# Altium schematic sheet Audio.SchDoc: Iris
size A3; Organization: Toradex AG; Address1: Altsagenstrasse 5; Address2: Horw; Address3: 6048; Address4: Switzerland; DocumentNumber: 13; Revision: V2.0; SheetNumber: 13; SheetTotal: 16
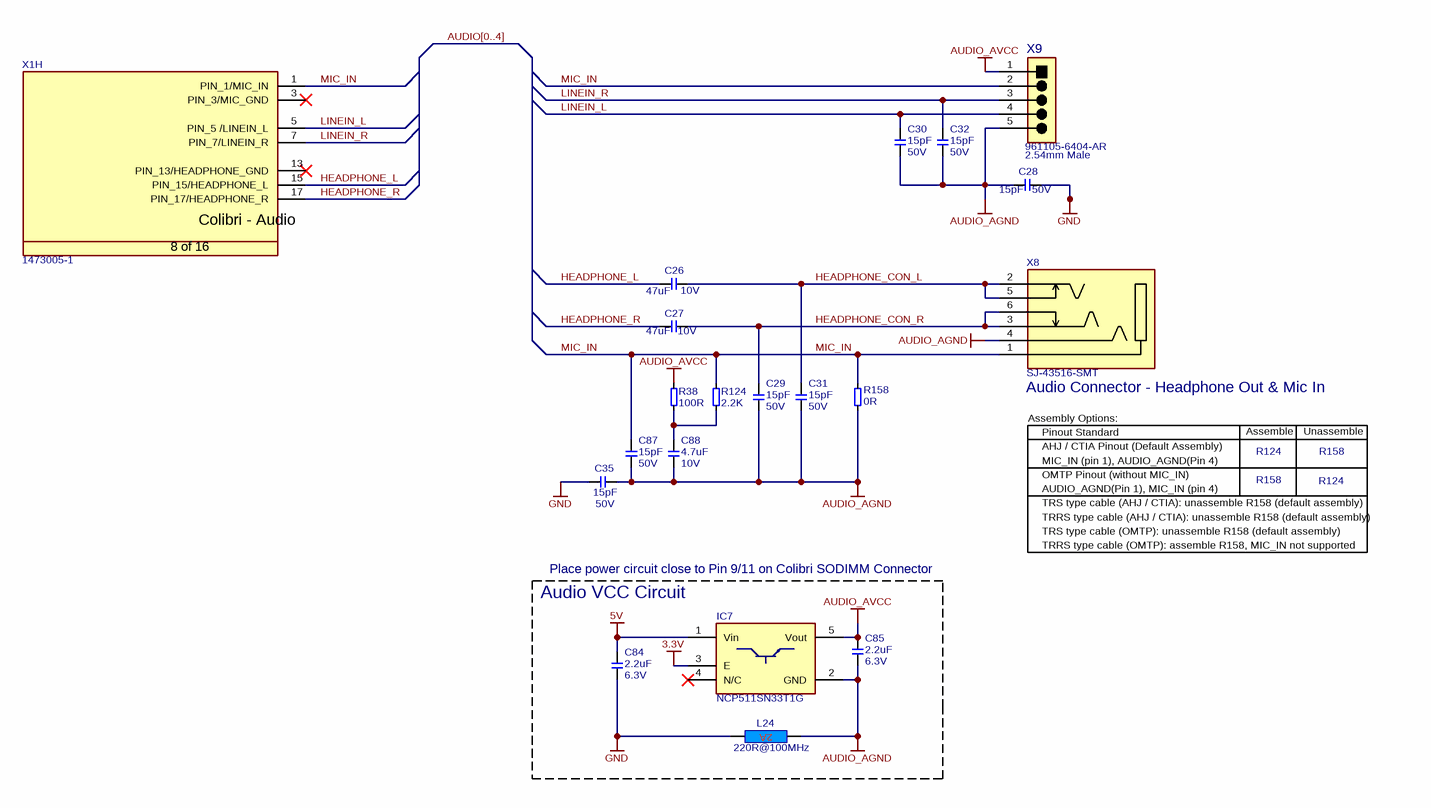
[diagram p0: Audio.SchDoc]

## Parts
C26  Rating: 10V  [T_CAPC0805X125N]  (hidden comment: 47uF)
C27  Rating: 10V  [T_CAPC0805X125N]  (hidden comment: 47uF)
C28  Rating: 50V  [CAPC1005X60N]  (hidden comment: 15pF)
C29  Rating: 50V  [CAPC1005X60N]  (hidden comment: 15pF)
C30  Rating: 50V  [CAPC1005X60N]  (hidden comment: 15pF)
C31  Rating: 50V  [CAPC1005X60N]  (hidden comment: 15pF)
C32  Rating: 50V  [CAPC1005X60N]  (hidden comment: 15pF)
C35  Rating: 50V  [CAPC1005X60N]  (hidden comment: 15pF)
C84  Rating: 6.3V  [T_CAPC0603X33N]  (hidden comment: 2.2uF)
C85  Rating: 6.3V  [T_CAPC0603X33N]  (hidden comment: 2.2uF)
C87  Rating: 50V  [CAPC1005X60N]  (hidden comment: 15pF)
C88  Rating: 10V  [T_CAPC0603X33N]  (hidden comment: 4.7uF)
IC7  NCP511SN33T1G  [SOT95P279X142-5N]
L24  220R@100MHz  [INDC1608X95N]
R38  100R  [T_RESC0603X30N]
R124  2.2K  [RESC1005X40N]
R158  0R  [T_RESC0603X30N]
X1  1473005-1  [T_Tyco_1473005-1]  (part H of 16)
X8  SJ-43516-SMT  [T_CI_SJ-43516-SMT]
X9  961105-6404-AR  [T_3M_961105-6404-AR]

## Blocks framed on the sheet
Audio VCC Circuit: C84 C85 IC7 L24

## Nets
3.3V: IC7.3(E)
5V: C84.2 IC7.1(Vin)
AUDIO_AGND: C28.1 C29.1 C30.1 C31.1 C32.1 C35.2 C85.1 C87.1 C88.1 IC7.2(GND) L24.1 R158.2 X8.4 X9.5
AUDIO_AVCC: C85.2 IC7.5(Vout) R38.1 X9.1
GND: C28.2 C35.1 C84.1 L24.2
HEADPHONE_CON_L: C26.2 C31.2 X8.2 X8.5
HEADPHONE_CON_R: C27.2 C29.2 X8.3 X8.6
HEADPHONE_L: C26.1 X1.15(PIN_15/HEADPHONE_L)
HEADPHONE_R: C27.1 X1.17(PIN_17/HEADPHONE_R)
LINEIN_L: C30.2 X1.5(PIN_5_/LINEIN_L) X9.4
LINEIN_R: C32.2 X1.7(PIN_7/LINEIN_R) X9.3
MIC_IN: C87.2 R124.2 R158.1 X1.1(PIN_1/MIC_IN) X8.1 X9.2
NetC88_2: C88.2 R38.2 R124.1

Not connected (* = marked no-connect by the designer): IC7 4(N/C)*; X1 3(PIN_3/MIC_GND)* 13(PIN_13/HEADPHONE_GND)*

## Buses and harness runs
bus AUDIO[0..4]

## Notes on the sheet
- 2.54mm Male
- (near X8) Audio Connector - Headphone Out & Mic In
- Assembly Options:
- AHJ / CTIA Pinout (Default Assembly)
- Pinout Standard
- Assemble
- R124
- Unassemble
- R158
- OMTP Pinout (without MIC_IN)
- MIC_IN (pin 1), AUDIO_AGND(Pin 4)
- AUDIO_AGND(Pin 1), MIC_IN (pin 4)
- TRS type cable (AHJ / CTIA): unassemble R158 (default assembly)
- TRRS type cable (AHJ / CTIA): unassemble R158 (default assembly)
- Place power circuit close to Pin 9/11 on Colibri SODIMM Connector
- TRRS type cable (OMTP): assemble R158, MIC_IN not supported
- TRS type cable (OMTP): unassemble R158 (default assembly)
- Title
- Size:
- Date:
- A3
- Number:
- Time:
- Revision:
- Sheet
- of
- File:
- (in symbol CON-Tyco-1473005-1-200-0.6mm, part H) Colibri - Audio; 8 of 16

## Library data of the parts
C26 C27 = C-X5R-47uF-10V-20%-0805: Capacitor Ceramic X5R 47uF 10V 20% 0805; Tolerance: 20%; Type: X5R; Value: 47uF
C28-C32 C35 C87 = C-NPO-15pF-50V-5%-0402: Capacitor Ceramic NPO 15pF 50V 5% 0402; Tolerance: 5%; Type: NPO; Value: 15pF
C84 C85 = C-X5R-2.2uF-6.3V-20%-0603: Capacitor Ceramic X5R 2.2uF 6.3V 20% 0603; Tolerance: 20%; Type: X5R; Value: 2.2uF
C88 = C-X5R-4.7uF-10V-10%-0603: Capacitor Ceramic X5R 4.7uF 10V 10% 0603; Manufacturer Name: Generic; Tolerance: 10%; Type: X5R; Manufacturer Part No.: *; Value: 4.7uF
IC7 = IC-ON-NCP511SN33T1G: NCP511SN33T1G LDO Regulator; Manufacturer Name: ON Semiconductor; Manufacturer Part No.: NCP511SN33T1G
L24 = L-220R@100MHz-2A-25%-0603: 220R@100MHz 2A EMI FILTER; Tolerance: 25%; Rating: 2A; Value: 220R@100MHz
R38 = R-100R-63mW-5%-0603: Resistor 100 ohm 63mW 5% 0603; Rating: 63mW; Tolerance: 5%; Value: 100R
R124 = R-2.2KR-63mW-5%-0402: Resistor 2.2 Kohm 63mW 5% 0402; Value: 2.2KR; Rating: 63mW; Tolerance: 5%
R158 = R-0R-63mW-5%-0603: Resistor 0 ohm 63mW 5% 0603; Rating: 63mW; Tolerance: 5%; Value: 0R; Size: 0603 (In)
X1 = CON-Tyco-1473005-1-200-0.6mm: SODIMM Connector; Manufacturer Name: Tyco; No. of ways: 200; Manufacturer Part No.: 1473005-1
X8 = CON-Cui-SJ-43516-SMT-6-3.5mm: 3.5mm Stereo Jack SMD with Detect Contact; Manufacturer Name: Cui INC; No. of ways: 6; Manufacturer Part No.: SJ-43516-SMT
X9 = CON-3M-961105-6404-AR: Audio Header 5 pins 2.54mm; Manufacturer Name: 3M; No. of ways: 1X5; Pitch: 2.54mm; Manufacturer Part No.: 961105-6404-AR